# EAGLE design RN41 (EAGLE 6.4)
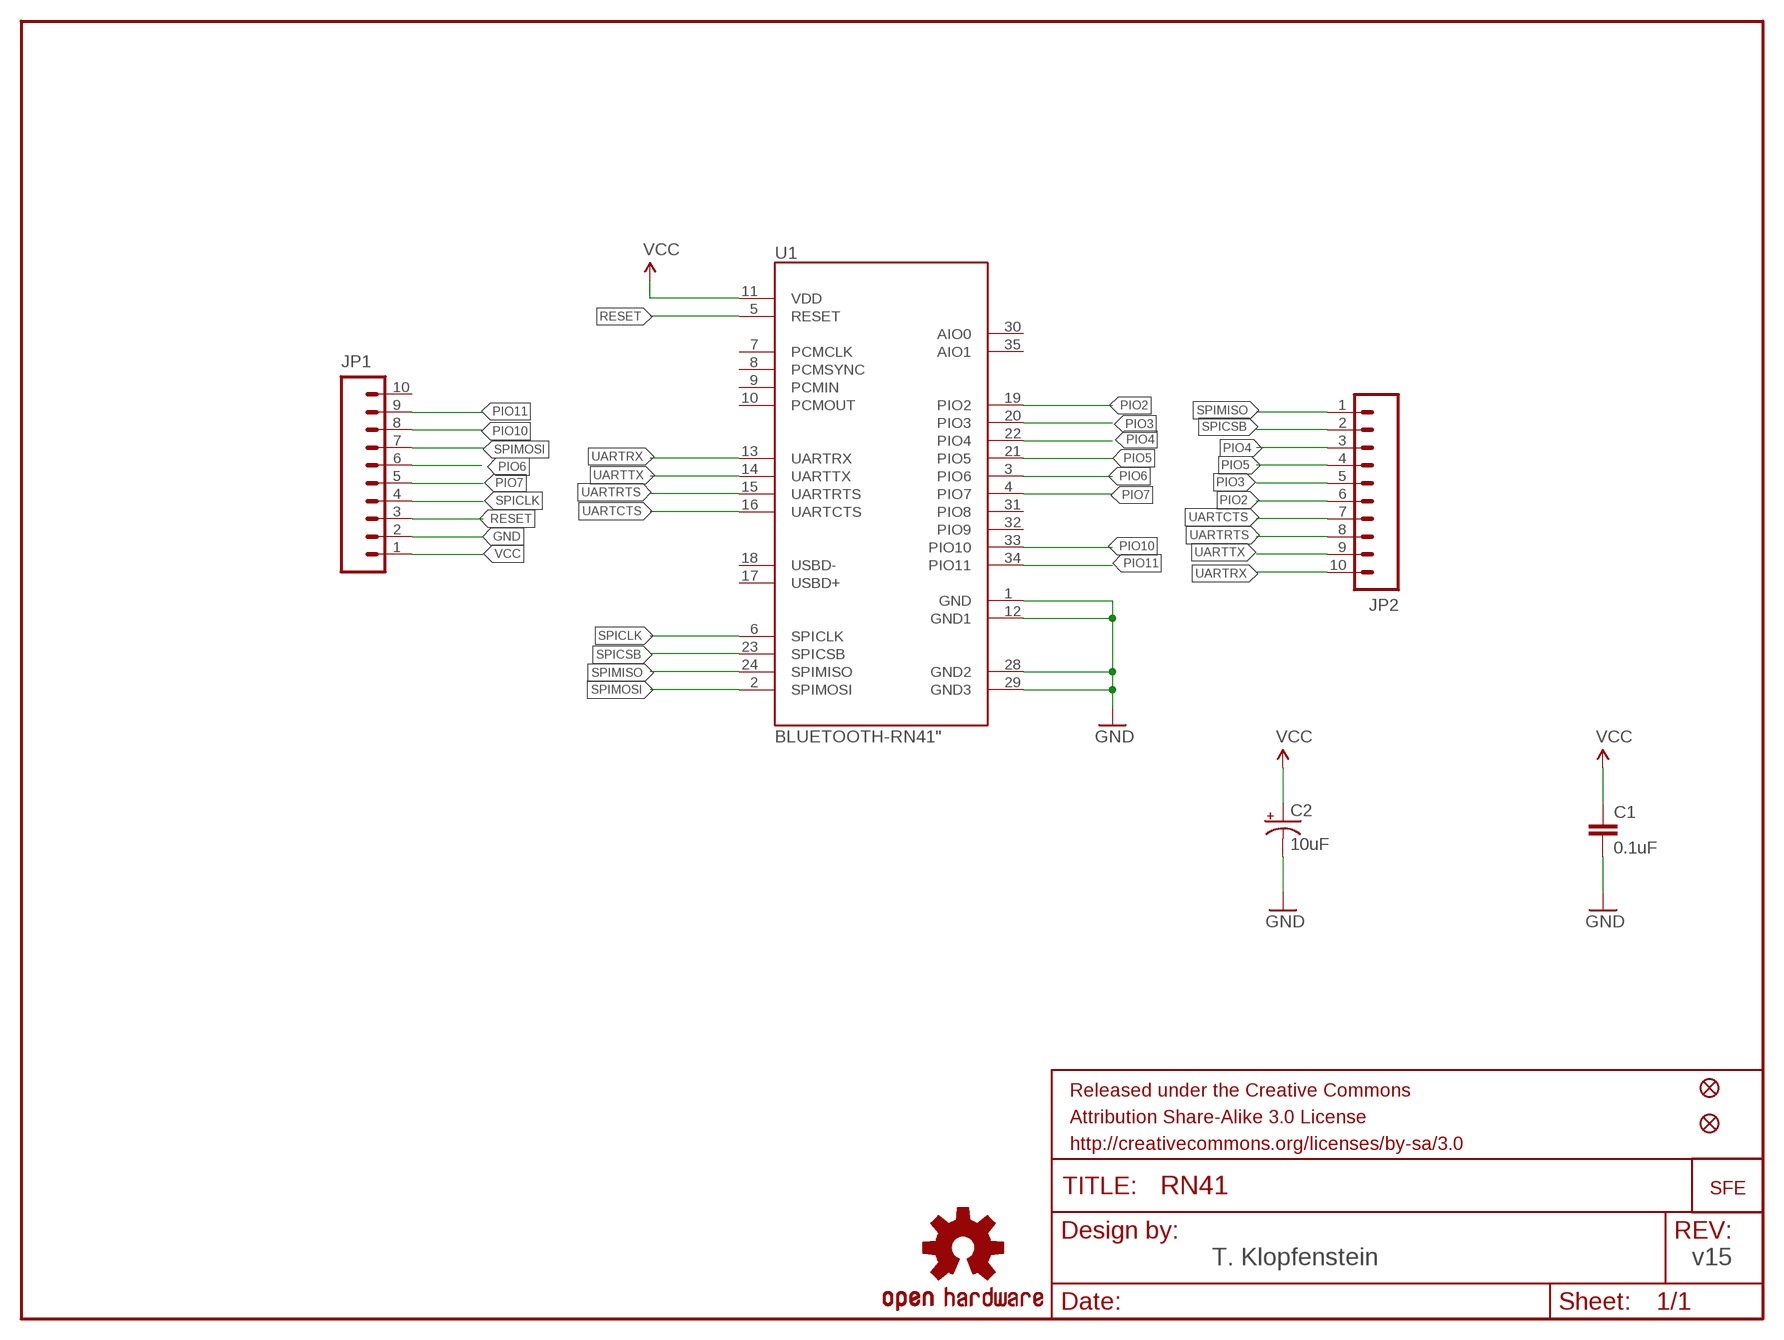
[diagram p0: schematic, sheet 1]

## Parts
C1  0.1uF  CAP0603-CAP  [0603-CAP]
C2  10uF  CAP_POL1206  [EIA3216]
FID1  FIDUCIALUFIDUCIAL  [MICRO-FIDUCIAL]
FID2  FIDUCIALUFIDUCIAL  [MICRO-FIDUCIAL]
FRAME1  FRAME-LETTER  [CREATIVE_COMMONS]
JP1  M10"  [1X10]
JP2  M10"  [1X10]
LOGO1  OSHW-LOGOS  [OSHW-LOGO-S]
U1  BLUETOOTH-RN41"  [RN41]
U$1  LOGO-SFENEW  [SFE-NEW-WEBLOGO]

## Nets
GND: C1.2 C2.C(-) JP1.2 U1.1(GND) U1.12(GND1) U1.28(GND2) U1.29(GND3)
PIO2: JP2.6 U1.19(PIO2)
PIO3: JP2.5 U1.20(PIO3)
PIO4: JP2.3 U1.22(PIO4)
PIO5: JP2.4 U1.21(PIO5)
PIO6: JP1.6 U1.3(PIO6)
PIO7: JP1.5 U1.4(PIO7)
PIO10: JP1.8 U1.33(PIO10)
PIO11: JP1.9 U1.34(PIO11)
RESET: JP1.3 U1.5(RESET)
SPICLK: JP1.4 U1.6(SPICLK)
SPICSB: JP2.2 U1.23(SPICSB)
SPIMISO: JP2.1 U1.24(SPIMISO)
SPIMOSI: JP1.7 U1.2(SPIMOSI)
UARTCTS: JP2.7 U1.16(UARTCTS)
UARTRTS: JP2.8 U1.15(UARTRTS)
UARTRX: JP2.10 U1.13(UARTRX)
UARTTX: JP2.9 U1.14(UARTTX)
VCC: C1.1 C2.A(+) JP1.1 U1.11(VDD)
Unconnected: JP1.10 U1.7(PCMCLK) U1.8(PCMSYNC) U1.9(PCMIN) U1.10(PCMOUT) U1.17(USBD+) U1.18(USBD-) U1.30(AIO0) U1.31(PIO8) U1.32(PIO9) U1.35(AIO1)

## Notes on the sheet
- T. Klopfenstein | v15

## Library data of the parts
C1 = SparkFun:CAP: Capacitor Standard 0603 ceramic capacitor, and 0.1" leaded capacitor.
C2 = SparkFun:CAP_POL: Capacitor Polarized These are standard SMD and PTH capacitors. Normally 10uF, 47uF, and 100uF in electrolytic and tantalum varieties. Always verify the external diameter of the through hole cap, it varies with capacity, voltage, and manufacturer. The EIA devices should be standard.
FID1 FID2 = SparkFun-Aesthetics:FIDUCIAL: Fiducial Alignment Points Various fiducial points for machine vision alignment.
FRAME1 = SparkFun-Aesthetics:FRAME-LETTER: Schematic Frame Standard 8.5x11 US Letter frame
JP1 JP2 = SparkFun:M10: Header 10 Standard 10-pin 0.1" header. Use with straight break away headers (SKU : PRT-00116), right angle break away headers (PRT-00553), swiss pins (PRT-00743), machine pins (PRT-00117), and female headers (PRT-00115).
LOGO1 = SparkFun-Aesthetics:OSHW-LOGO: Open Source Hardware Logo This logo indicates the piece of hardware it is found on incorporates a OSHW license and/or adheres to the definition of open source hardware found here: http://freedomdefined.org/OSHW
U1 = SparkFun-RF:BLUETOOTH-RN41: Bluetooth SMD module
U$1 = SparkFun:LOGO-SFE: Spark Fun Electronics PCB Logo This is the standard Spark Fun Electronics PCB logo.

## Board
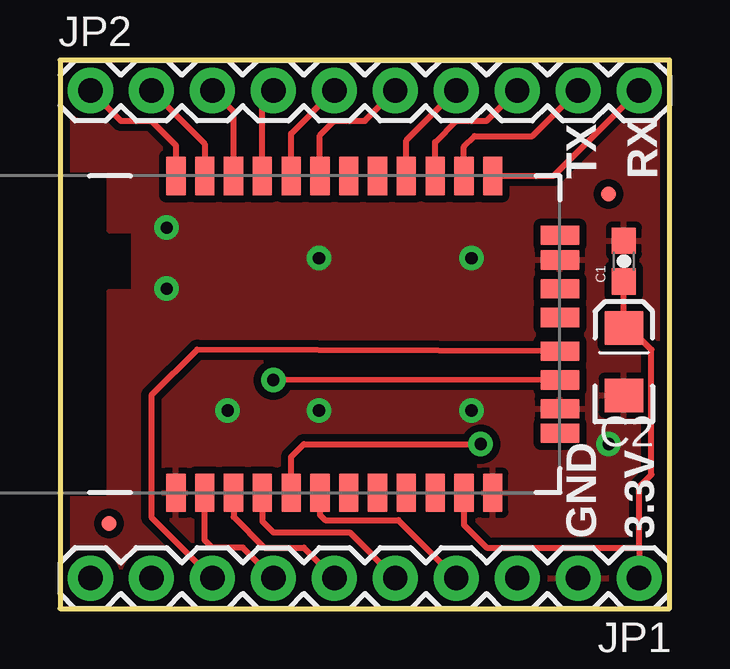
[diagram p1: board, top side]
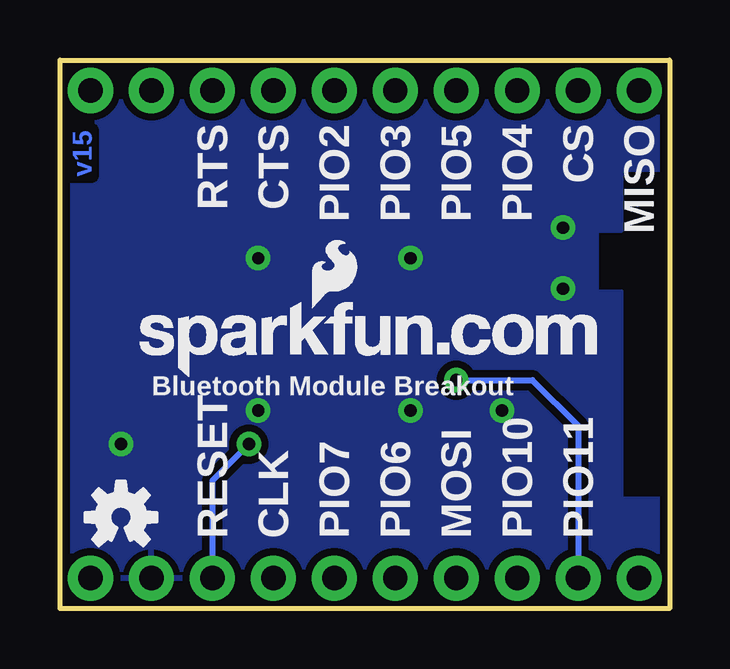
[diagram p2: board, bottom side, seen from below]

Size 25.4 x 22.86 mm. Coordinates in mm from the lower left corner, seen from the top.
Outline: 0,0 25.4,0 25.4,22.86 0,22.86 0,0
Copper layers (1*16): Top 0.035mm / dielectric 1.5mm / Bottom 0.035mm
Design rules "SparkFun": minimum track width 8mil, minimum drill 20mil, track to track 8mil, track to pad 8mil, pad to pad 8mil, via to via 8mil, smd to smd 8mil, copper to edge 10mil, drill to drill 8mil, minimum pad ring 12mil, minimum via ring 10mil, stop-mask expansion 4mil, vias tented up to drill 25mil, thermal gap 10mil

### Footprints (pad centres in the part's own frame; a part is rotated, then mirrored left to right if it is on the bottom)
0603-CAP = smd 1.1 x 1: 1 -0.85,0; 2 0.85,0
EIA3216 = smd 1.4 x 1.6: A 1.4,0; C -1.4,0
MICRO-FIDUCIAL = smd 0.635 x 0.635: 1 0,0
1X10 = drill 1.016 pad 1.88: 1 0,0; 2 2.54,0; 3 5.08,0; 4 7.62,0; 5 10.16,0; 6 12.7,0; 7 15.24,0; 8 17.78,0; 9 20.32,0; 10 22.86,0
RN41 = smd 0.8 x 1.6: 1 -6.6,-6.6; 2 -5.4,-6.6; 3 -4.2,-6.6; 4 -3,-6.6; 5 -1.8,-6.6; 6 -0.6,-6.6; 7 0.6,-6.6; 8 1.8,-6.6; 9 3,-6.6; 10 4.2,-6.6; 11 5.4,-6.6; 12 6.6,-6.6; 13 6.6,6.6; 14 5.4,6.6; 15 4.2,6.6; 16 3,6.6; 17 1.8,6.6; 18 0.6,6.6; 19 -0.6,6.6; 20 -1.8,6.6; 21 -3,6.6; 22 -4.2,6.6; 23 -5.4,6.6; 24 -6.6,6.6 | smd 1.6 x 0.8: 28 9.4,3.1; 29 9.4,-3.1; 30 9.4,4.122; 31 9.4,1.9; 32 9.4,0.7; 33 9.4,-0.7; 34 9.4,-1.9; 35 9.4,-4.122

### Placement (x,y rotation side)
C1  23.5,14.48 90 top
C2  23.5,10.29 90 top
FID1  22.86,17.27 0 top
FID2  2.03,3.56 0 top
FRAME1  -7.69,-21.59 0 top  (outside the outline)
JP1  24.13,1.27 180 top
JP2  1.27,21.59 0 top
LOGO1  22.86,3.81 0 bottom
U1  11.43,11.43 0 top
U$1  22.1,9.65 0 bottom

### Tracks (layer width: path | path; a pad name or v marks a point on that pad's centre or on a via)
GND  (via drill 0.51)
  other vias: 22.86,6.86 4.45,15.88 4.45,13.34 10.79,14.61 17.14,14.61 6.99,8.26 10.79,8.26 17.14,8.26
  pour Bottom (isolate 0.305): 0,22.86 0,18.29 2.03,18.29 2.03,15.75 3.05,15.75 3.05,13.21 2.03,13.21 2.03,4.57 0,4.57 0,0 25.4,0 25.4,22.86
  pour Top (isolate 0.305): 0,22.86 0,18.29 2.03,18.29 2.03,15.75 3.05,15.75 3.05,13.21 2.03,13.21 2.03,4.57 0,4.57 0,0 25.4,0 25.4,22.86
PIO2
  Top 0.254: U1.19 10.83,19.72 11.43,20.32 12.7,20.32 JP2.6
PIO3
  Top 0.254: U1.20 9.63,19.79 JP2.5
PIO4
  Top 0.254: U1.22 7.23,20.71 JP2.3
PIO5
  Top 0.254: U1.21 8.43,21.13 JP2.4
PIO6
  Top 0.254: U1.3 7.23,3.82 8.51,2.54 10.16,2.54 JP1.6
PIO7
  Top 0.254: U1.4 8.43,3.63 8.89,3.17 12.06,3.17 JP1.5
PIO10
  Top 0.254: U1.33 5.71,10.79 3.81,8.89 3.81,3.81 JP1.8
PIO11  (via drill 0.51)
  Top 0.254: U1.34 v8.89,9.53
  Bottom 0.254: v8.89,9.53 5.71,9.53 3.81,7.62 JP1.9
RESET  (via drill 0.51)
  Top 0.254: U1.5 9.63,6.33 10.16,6.86 v17.53,6.86
  Bottom 0.254: v17.53,6.86 19.05,5.33 JP1.3
SPICLK
  Top 0.254: U1.6 10.83,3.9 11.05,3.68 14.1,3.68 JP1.4
SPICSB
  Top 0.254: U1.23 6.03,19.37 JP2.2
SPIMISO
  Top 0.254: U1.24 4.83,19.3 3.81,20.32 2.54,20.32 JP2.1
SPIMOSI
  Top 0.254: U1.2 6.03,2.86 6.35,2.54 7.62,2.54 JP1.7
UARTCTS
  Top 0.254: U1.16 14.43,19.51 JP2.7
UARTRTS
  Top 0.254: U1.15 15.63,19.44 16.51,20.32 17.78,20.32 JP2.8
UARTRX
  Top 0.254: U1.13 20.57,18.03 JP2.10
UARTTX
  Top 0.254: U1.14 16.83,19.24 17.27,19.68 19.68,19.68 JP2.9
VCC
  Top 0.203: C2.A 23.5,11.58 23.47,11.58 | C2.A 23.47,11.68 | C2.A
  Top 0.254: 23.62,11.68 23.75,11.68 24.64,10.79 24.64,5.59 24.13,5.08 24.13,2.54 | 23.62,11.68 C2.A | 24.13,2.54 JP1.1 | 24.13,2.54 17.78,2.54 16.83,3.49 U1.11 | 23.62,11.68 23.62,11.69 | 23.62,11.69 C2.A | C1.1 23.5,11.81 23.62,11.69

### Text on the board
Bottom: v15
tPlace: TX | RX | GND | 3.3V
bPlace: MISO | CS | PIO4 | PIO5 | PIO3 | PIO2 | CTS | RTS | Bluetooth Module Breakout | PIO11 | PIO10 | MOSI | PIO6 | PIO7 | CLK | RESET
Measures: All Dimensions in mil | Spark Fun Electronics | 900 | 850 | 50 | 0 | 0 | 0 | 0 | 0 | 50 | 150 | 250 | 350 | 450 | 550 | 650 | 750 | 850 | 950 | 1000
Document: T. Klopfenstein | T. Klopfenstein